# EAGLE design HoverPuck (EAGLE 7.2.0)
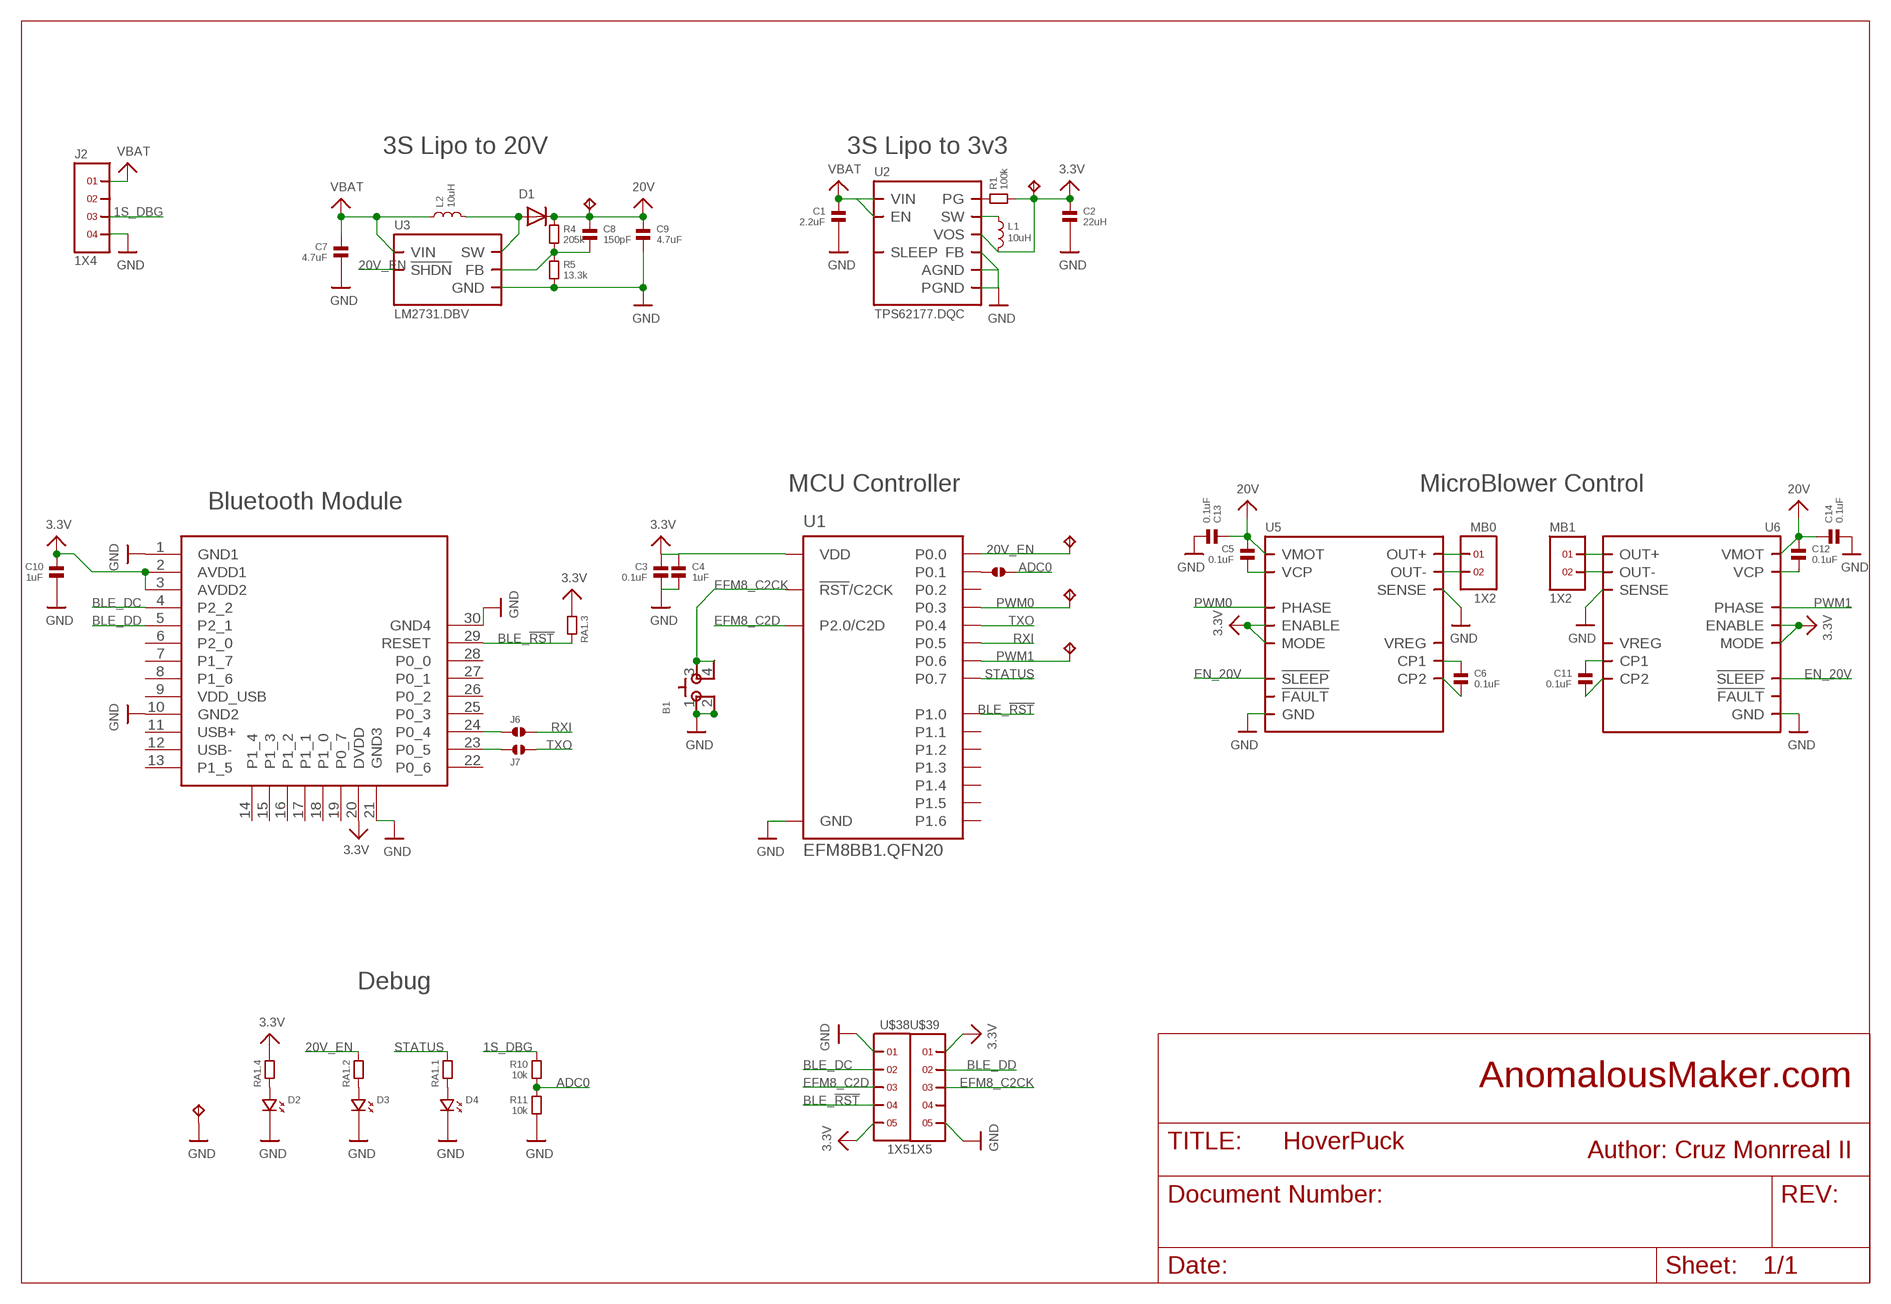
[diagram p0: schematic, sheet 1]

## Parts
B1  SKSCLDE010  [SKSCLDE010]
C1  2.2uF  CAPACITOR.0603  [0603]
C2  22uH  CAPACITOR.0805  [0805]
C3  0.1uF  CAPACITOR.0603  [0603]
C4  1uF  CAPACITOR.0603  [0603]
C5  0.1uF  CAPACITOR.0603  [0603]
C6  0.1uF  CAPACITOR.0603  [0603]
C7  4.7uF  CAPACITOR.0805  [0805]
C8  150pF  CAPACITOR.0603  [0603]
C9  4.7uF  CAPACITOR.0805  [0805]
C10  1uF  CAPACITOR.0603  [0603]
C11  0.1uF  CAPACITOR.0603  [0603]
C12  0.1uF  CAPACITOR.0603  [0603]
C13  0.1uF  CAPACITOR.0603  [0603]
C14  0.1uF  CAPACITOR.0603  [0603]
D1  MBR0530T1G  DIODESOD-123  [SOD-123]
D2  LED.0603  [0603.LED]
D3  LED.0603  [0603.LED]
D4  LED.0603  [0603.LED]
J1  SOLDERJUMPER.2.SML.PASTE  [2.SML.PASTE]
J2  1X4  [1X4]
J6  SOLDERJUMPER.2.SML.PASTE  [2.SML.PASTE]
J7  SOLDERJUMPER.2.SML.PASTE  [2.SML.PASTE]
L1  10uH  INDUCTOR.LPS4018  [LPS4018]
L2  10uH  INDUCTOR-SRN6045  [SRN6045]
MB0  1X2  [1X2]
MB1  1X2  [1X2]
R1  100k  RESISTOR.0603  [0603]
R4  205k  RESISTOR.0603  [0603]
R5  13.3k  RESISTOR.0603  [0603]
R10  10k  RESISTOR.0603  [0603]
R11  10k  RESISTOR.0603  [0603]
RA1  RA-4.0603  [0603.4.C]
TP1  TPTP06R  [TP06R]
TP2  TPTP06R  [TP06R]
TP3  TPTP06R  [TP06R]
TP4  TPTP06R  [TP06R]
TP5  TPTP06R  [TP06R]
TP6  TPTP06R  [TP06R]
U1  EFM8BB1.QFN20  [QFN20]
U2  TPS62177.DQC  [DQC]
U3  LM2731.DBV  [DBV.5]
U4  BLE112-A  [BLE112-A]
U5  DRV8800.RTY  [RTY.16]
U6  DRV8800.RTY  [RTY.16]
U$38  1X5  [1X5]
U$39  1X5  [1X5]

## Nets
1S_DBG: J2.3 R10.1
3.3V: C2.1 C3.1 C4.1 C10.1 L1.2 R1.2 RA1.6 RA1.8 TP1.TP U1.4(VDD) U2.10(VOS) U4.2(AVDD1) U4.3(AVDD2) U4.20(DVDD) U5.4(ENABLE) U5.16(MODE) U6.4(ENABLE) U6.16(MODE) U$38.5 U$39.1
12V: C5.1 C12.1 C13.1 C14.1 U5.8(VMOT) U6.8(VMOT) ; supply symbol labelled 20V
20V: C8.1 C9.1 D1.C R4.1 TP2.TP
20V_EN: RA1.4 TP5.TP U1.2(P0.0) U3.4(!SHDN)
ADC0: J1.2 R10.2 R11.1
BLE_!RST: RA1.5 U1.14(P1.0) U4.29(RESET) U$38.4
BLE_DC: U4.4(P2_2) U$38.2
BLE_DD: U4.5(P2_1) U$39.2
EFM8_C2CK: B1.3 B1.4 U1.5(!RST!/C2CK) U$39.3
EFM8_C2D: U1.6(P2.0/C2D) U$38.3
EN_20V: U5.3(!SLEEP) U6.3(!SLEEP)
GND: B1.1 B1.2 C1.2 C2.2 C3.2 C4.2 C7.2 C9.2 C10.2 C13.2 C14.2 D2.P$2 D3.P$2 D4.P$2 J2.4 R5.2 R11.2 TP6.TP U1.3(GND) U1.12(GND) U1.PAD(GND) U2.1(PGND) U2.5(FB) U2.6(AGND) U2.PAD(PGND) U3.2(GND) U4.1(GND1) U4.10(GND2) U4.21(GND3) U4.30(GND4) U5.2(GND) U5.7(SENSE) U5.12(GND) U5.PAD(GND) U6.2(GND) U6.7(SENSE) U6.12(GND) U6.PAD(GND) U$38.1 U$39.5
N$1: C12.2 U6.13(VCP)
N$2: C5.2 U5.13(VCP)
N$3: L1.1 U2.9(SW)
N$4: D2.P$1 RA1.7
N$5: D1.A L2.2 U3.1(SW)
N$6: R1.1 U2.7(PG)
N$7: C8.2 R4.2 R5.1 U3.3(FB)
N$8: D4.P$1 RA1.1
N$9: D3.P$1 RA1.3
N$10: J6.1 U4.24(P0_4)
N$11: J7.1 U4.23(P0_5)
N$12: J1.1 U1.1(P0.1)
N$13: MB0.1 U5.6(OUT+)
N$14: MB0.2 U5.9(OUT-)
N$15: MB1.1 U6.6(OUT+)
N$16: MB1.2 U6.9(OUT-)
N$17: C6.1 U5.10(CP1)
N$18: C6.2 U5.11(CP2)
N$19: C11.2 U6.11(CP2)
N$20: C11.1 U6.10(CP1)
PWM0: TP3.TP U1.19(P0.3) U5.1(PHASE)
PWM1: TP4.TP U1.16(P0.6) U6.1(PHASE)
RXI: J6.2 U1.17(P0.5)
STATUS: RA1.2 U1.15(P0.7)
TXO: J7.2 U1.18(P0.4)
VBAT: C1.1 C7.1 J2.1 L2.1 U2.2(VIN) U2.3(EN) U3.5(VIN)
Unconnected: J2.2 U1.7(P1.6) U1.8(P1.5) U1.9(P1.4) U1.10(P1.3) U1.11(P1.2) U1.13(P1.1) U1.20(P0.2) U2.8(SLEEP) U4.6(P2_0) U4.7(P1_7) U4.8(P1_6) U4.9(VDD_USB) U4.11(USB+) U4.12(USB-) U4.13(P1_5) U4.14(P1_4) U4.15(P1_3) U4.16(P1_2) U4.17(P1_1) U4.18(P1_0) U4.19(P0_7) U4.22(P0_6) U4.25(P0_3) U4.26(P0_2) U4.27(P0_1) U4.28(P0_0) U5.14(VREG) U5.15(!FAULT) U6.14(VREG) U6.15(!FAULT) U$39.4

## Notes on the sheet
- 3S Lipo to 20V | 3S Lipo to 3v3
- MCU Controller | MicroBlower Control
- Bluetooth Module
- Debug
- AnomalousMaker.com
- Author: Cruz Monrreal II

## Library data of the parts
B1 = alps:SKSCLDE010
C1-C14 = standardparts:CAPACITOR
D1 = microbuilder:DIODE: Diode SMA Model Volts Amps Type Vf Vr Digikey # Notes SSA34-E3 40V 3A Schottky 480mV @ 3A 200uA @ 40V SSA34-E3/61TGITR-ND CDBA120-G 20V 1A Schottky 500mV @ 1A 500uA @ 20V 641-1014-6-ND REEL MBRA210 10V 2A Schottky 350mV @ 2A 700uA @ 10V MBRA210LT3 SOD-123 Model Volts Amps Type Vf Vr Order # Notes BAT54T1G 30V 200mA Schottky 800mV @ 200mA 2uA @ 25V BAT54T1GOSTR-ND B0530W 30V 500mA Schottky 430mV @ 500mA 130uA @ 30V B0530W-FDICT-ND REEL MBR120 1A 20V Schottky 340mV @ 1A MBR120VLSFT1GOSCT-ND SOD-323 Model Volts Amps Type Vf Vr Order # Notes PMEG2005EJ 20V 500mA Schottky 355mV @ 500mA 568-4110-1-ND ZLLS410 10V 570mA Schottky 380mV @ 570mA ZLLS410CT-ND 1N4148WS 75V 150mA Silicon/Simple 1V 1N4148WSFSCT-ND REEL SOD-523 Model Volts Amps Type Vf Vr Order # Notes BAT54XV2 30V 200mA Schottky 0.8V @ 100mA BAT54XV2CT-ND TB751S 30V 30mA Schottky RB751S-40TE61CT-ND SOT23-R/W (R = Solder Paste/Reflow Ovens, W = Hand-Soldering) Model Volts Amps Type Vf Vr Order # Notes BAT54FILM 40V 300mA Schottky 497-7162-1-ND
D2-D4 = standardparts:LED
J1 J6 J7 = solderjumper:SOLDERJUMPER.2
J2 = headers.edge(.1in):1X4
L1 = coilcraft:INDUCTOR
L2 = bourns:INDUCTOR
MB0 MB1 = headers.edge(.1in):1X2
R1 R4 R5 R10 R11 = standardparts:RESISTOR
RA1 = resistorarray:RA-4: Dimentions sources from here: http://www.ctscorp.com/components/Datasheets/CTSChipArrayDs.pdf
TP1-TP6 = testpad:TP: Test pad
U1 = silabs:EFM8BB1
U2 = packages(ti):TPS62177
U3 = packages(ti):LM2731
U4 = SparkFun-RF:BLE112-A: BlueGiga Bluetooth 4.0 module with integrated chip antenna and onboard 8051 processor and peripherals
U5 U6 = packages(ti):DRV8800
U$38 U$39 = headers(.05in):1X5

## Board
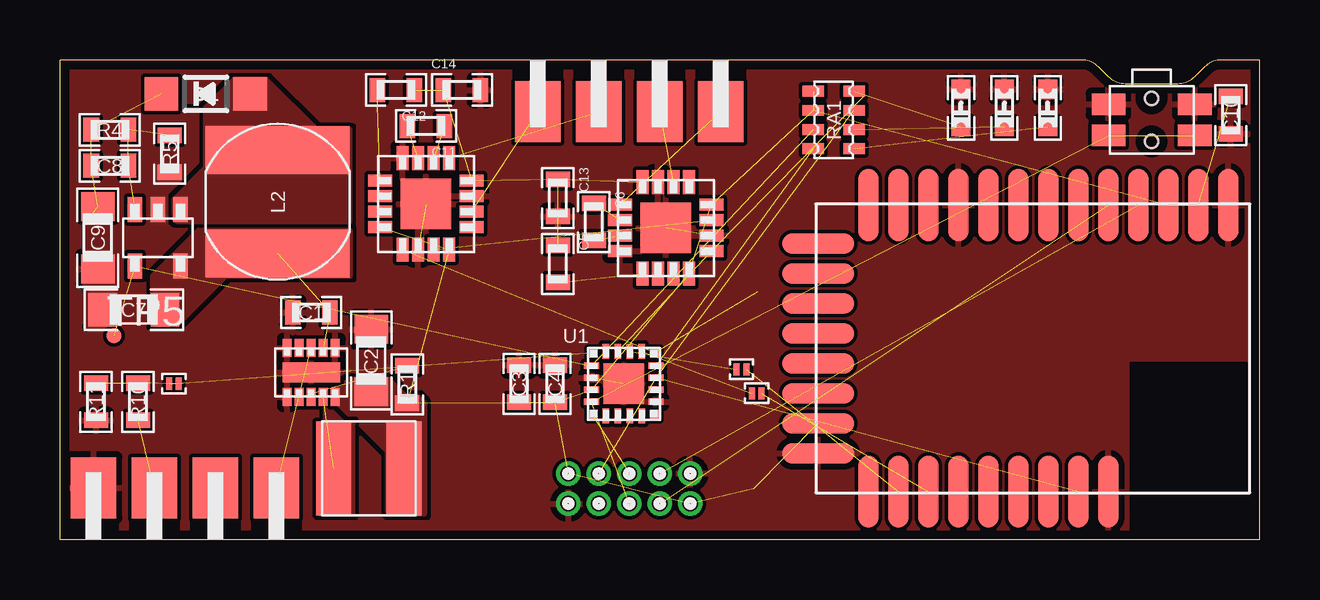
[diagram p1: board, top side]
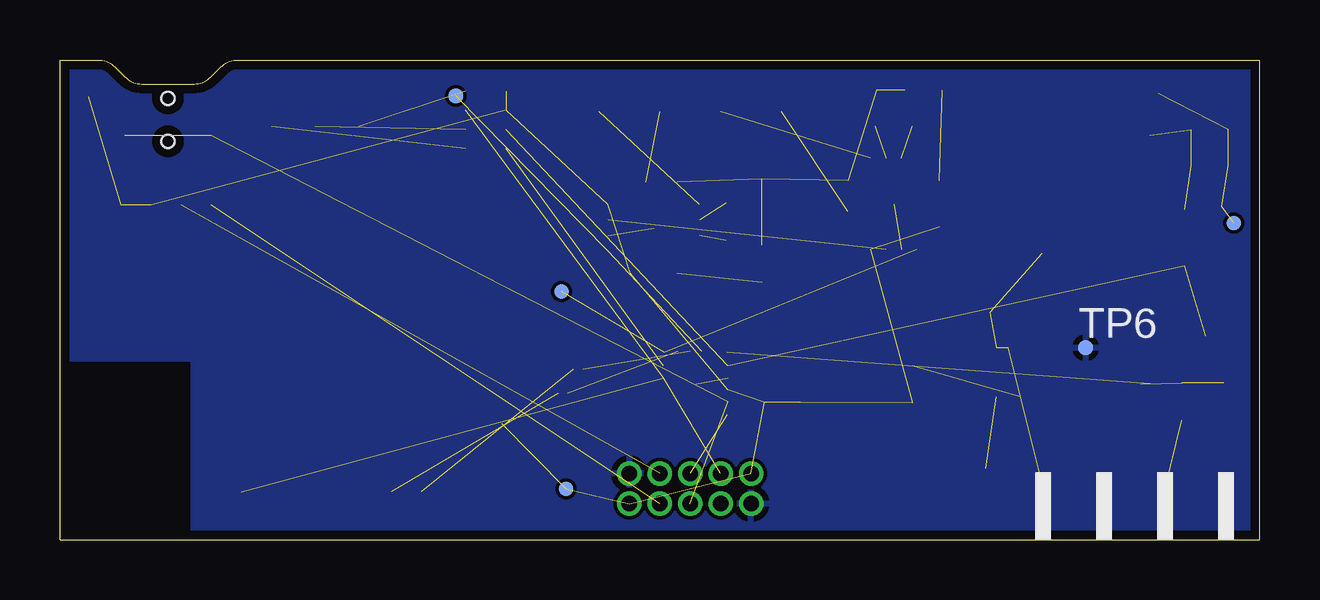
[diagram p2: board, bottom side, seen from below]

Size 50 x 20 mm. Coordinates in mm from the lower left corner, seen from the top.
Outline: 50,0 50,20 48.41,20 arc45 47.71,19.71 47.29,19.29 arc-45 46.59,19 44.41,19 arc-45 43.71,19.29 43.29,19.71 arc45 42.59,20 0,20 0,0 50,0
Copper layers (1*16): Top 0.0356mm / dielectric 1.5011mm / Bottom 0.0356mm
Design rules "OSHPark": minimum track width 6mil, minimum drill 13mil, track to track 6mil, track to pad 6mil, pad to pad 6mil, via to via 6mil, smd to smd 6mil, copper to edge 15mil, drill to drill 6mil, minimum pad ring 7mil, minimum via ring 7mil, stop-mask expansion 4mil, vias tented up to drill 16mil, thermal gap 10mil
tRestrict: 7 lines

### Footprints (pad centres in the part's own frame; a part is rotated, then mirrored left to right if it is on the bottom)
SKSCLDE010 = smd 1.4 x 0.9: 1 -1.8,-0.65; 2 1.8,-0.65; 3 -1.8,0.65; 4 1.8,0.65 | hole 0.55: 0,0.9; 0,-0.9
0603 = smd 0.65 x 1: 1 -0.775,0; 2 0.775,0
0805 = smd 1.2 x 1.4: 1 -1.3,0; 2 1.3,0
SOD-123 = smd 1.4 x 1.4: A 1.85,0; C -1.85,0
0603.LED = smd 0.8 x 0.8: P$1 -0.775,0; P$2 0.775,0
2.SML.PASTE = smd 0.254 x 0.508: 1 -0.203,0; 2 0.203,0
1X4 = smd 1.905 x 2.54: 1 0,-2.159; 2 2.54,-2.159; 3 5.08,-2.159; 4 7.62,-2.159
LPS4018 = smd 1.45 x 3.9: 1 -1.47,0; 2 1.47,0
SRN6045 = smd 2 x 6: 1 -2.15,0; 2 2.15,0
1X2 = smd 1.905 x 2.54: 1 0,-2.159; 2 2.54,-2.159
0603.4.C = smd 0.45 x 0.9: 1 -1.2,-0.85; 2 -1.2,0.85; 3 -0.4,-0.85; 4 -0.4,0.85; 5 0.4,-0.85; 6 0.4,0.85; 7 1.2,-0.85; 8 1.2,0.85
TP06R = smd 0.6 x 0.6: TP 0,0
QFN20 = smd 0.4 x 0.4: 1 -1.3,1.3; 6 -1.3,-1.3; 11 1.3,-1.3; 16 1.3,1.3 | smd 0.61 x 0.28: 2 -1.345,0.75; 3 -1.345,0.25; 4 -1.345,-0.25; 5 -1.345,-0.75; 12 1.345,-0.75; 13 1.345,-0.25; 14 1.345,0.25; 15 1.345,0.75 | smd 0.28 x 0.61: 7 -0.75,-1.345; 8 -0.25,-1.345; 9 0.25,-1.345; 10 0.75,-1.345; 17 0.75,1.345; 18 0.25,1.345; 19 -0.25,1.345; 20 -0.75,1.345 | smd 1.7 x 1.7: PAD 0,0
DQC = smd 0.75 x 0.37: 1 -1.025,1; 2 -1.025,0.5; 3 -1.025,0; 4 -1.025,-0.5; 5 -1.025,-1; 6 1.025,-1; 7 1.025,-0.5; 8 1.025,0; 9 1.025,0.5; 10 1.025,1 | smd 0.84 x 2.4: PAD 0,0
DBV.5 = smd 1.05 x 0.6: 1 -1.175,0.95; 2 -1.175,0; 3 -1.175,-0.95; 4 1.175,-0.95; 5 1.175,0.95
BLE112-A = smd 3 x 0.85: 1 0.05,17.2; 2 0.05,15.95; 3 0.05,14.7; 4 0.05,13.45; 5 0.05,12.2; 6 0.05,10.95; 7 0.05,9.7; 8 0.05,8.45; 9 0.05,7.2; 10 0.05,5.95; 11 0.05,4.7; 12 0.05,3.45; 13 0.05,2.2; 22 12,2.2; 23 12,3.45; 24 12,4.7; 25 12,5.95; 26 12,7.2; 27 12,8.45; 28 12,9.7; 29 12,10.95; 30 12,12.2 | smd 0.85 x 3: 14 1.65,0.1; 15 2.9,0.1; 16 4.15,0.1; 17 5.4,0.1; 18 6.65,0.1; 19 7.9,0.1; 20 9.15,0.1; 21 10.4,0.1
RTY.16 = smd 1 x 0.5: 1 -1.9,0.975; 2 -1.9,0.325; 3 -1.9,-0.325; 4 -1.9,-0.975; 9 1.9,-0.975; 10 1.9,-0.325; 11 1.9,0.325; 12 1.9,0.975 | smd 0.5 x 1: 5 -0.975,-1.9; 6 -0.325,-1.9; 7 0.325,-1.9; 8 0.975,-1.9; 13 0.975,1.9; 14 0.325,1.9; 15 -0.325,1.9; 16 -0.975,1.9 | smd 2.1 x 2.1: PAD 0,0
1X5 = drill 0.635 pad 1.016: 1 0,0; 2 1.27,0; 3 2.54,0; 4 3.81,0; 5 5.08,0

### Placement (x,y rotation side)
B1  45.5,17.5 180 top
C1  10.47,9.47 180 top
C2  12.97,7.47 90 top
C3  19.14,6.5 90 top
C4  20.64,6.5 90 top
C5  20.75,11.5 270 top
C6  22.25,13.25 270 top
C7  3.08,9.59 180 top
C8  2.08,15.59 0 top
C9  1.57,12.59 270 top
C10  48.8,17.7 270 top
C11  15.25,17.25 180 top
C12  14,18.75 180 top
C13  20.75,14.25 270 top
C14  16.75,18.75 0 top
D1  6.08,18.59 0 top
D2  37.55,18 90 top
D3  39.37,18 90 top
D4  41.17,18 90 top
J1  4.75,6.5 0 top
J2  9.02,0 180 top
J6  29.04,6.09 180 top
J7  28.41,7.09 180 top
L1  12.88,2.97 0 top
L2  9.07,14.09 90 top
MB0  25,20 0 top
MB1  19.92,20 0 top
R1  14.47,6.47 270 top
R4  2.08,17.09 0 top
R5  4.58,16.09 270 top
R10  3.25,5.75 90 top
R11  1.5,5.75 270 top
RA1  32.25,17.5 90 top
TP1  28.91,2.11 0 bottom
TP2  1.06,13.19 270 bottom
TP3  33.5,18.5 0 bottom
TP4  29.1,10.34 0 bottom
TP5  2.25,8.5 0 top
TP6  7.25,8 0 bottom
U1  23.5,6.5 0 top
U2  10.47,6.97 270 top
U3  4.08,12.59 270 top
U4  31.5,14 270 top
U5  25.25,13 180 top
U6  15.25,14 90 top
U$38  26.27,2.75 180 top
U$39  26.27,1.5 180 top

### Tracks (layer width: path | path; a pad name or v marks a point on that pad's centre or on a via)
1S_DBG  (1 unrouted)
3.3V  (16 unrouted)
  pour Top (rank 2, no thermals): 15.18,1.07 13.78,1.07 13.68,1.17 13.68,3.67 12.38,4.97 11.88,4.97 11.28,5.57 11.28,6.27 11.68,6.27 12.07,6.67 13.68,6.67 14.38,5.97 14.88,5.97 15.18,5.67
12V  (5 unrouted)
20V  (4 unrouted)
20V_EN  (3 unrouted)
ADC0  (2 unrouted)
BLE_!RST  (3 unrouted)
BLE_DC  (1 unrouted)
BLE_DD  (1 unrouted)
EFM8_C2CK  (3 unrouted)
EFM8_C2D  (1 unrouted)
EN_20V  (1 unrouted)
GND  (3 unrouted)
  pour Top (rank 6): 0,0 44.5,0 44.5,7.5 50,7.5 50,20 0,20
  pour Bottom (rank 6): 0,20 50,20 50,7.5 44.5,7.5 44.5,0 0,0
  pour Top (rank 3, no thermals): 1.31,8.48 2.98,8.48 3.67,9.19 3.67,10.79 5.97,13.09 5.97,17.79 2.38,17.79 1.77,17.18 1.77,13.69 1.01,12.92 1.01,9.12
N$1  (1 unrouted)
N$2  (1 unrouted)
N$3  (1 unrouted)
  pour Top (no thermals): 12.18,1.07 10.88,1.07 10.88,6.27 11.07,6.27 11.07,5.57 11.78,4.87 12.18,4.87
N$4  (1 unrouted)
N$5
  pour Top (rank 2, no thermals): 12.07,13.29 12.07,17.09 10.68,17.09 8.57,19.18 7.28,19.18 6.08,17.98 6.08,15.48 4.78,14.19 4.78,13.38 4.88,13.29
N$6  (1 unrouted)
N$7  (3 unrouted)
N$8  (1 unrouted)
N$9  (1 unrouted)
N$10  (1 unrouted)
N$11  (1 unrouted)
N$12  (1 unrouted)
N$13  (1 unrouted)
N$14  (1 unrouted)
N$15  (1 unrouted)
N$16  (1 unrouted)
N$17  (1 unrouted)
N$18  (1 unrouted)
N$19  (1 unrouted)
N$20  (1 unrouted)
PWM0  (2 unrouted)
PWM1  (2 unrouted)
RXI  (1 unrouted)
STATUS  (1 unrouted)
TXO  (1 unrouted)
VBAT  (4 unrouted)
  pour Top (no thermals): 12.07,10.98 6.88,10.98 4.88,8.98 3.88,8.98 3.88,10.98 5.78,12.88 12.07,12.88

### Text on the board
bDocu: PWM1 | 20v | PWM0 | 3.3v | HoverPuck | Cruz Monrreal II / AnomalousMaker.com